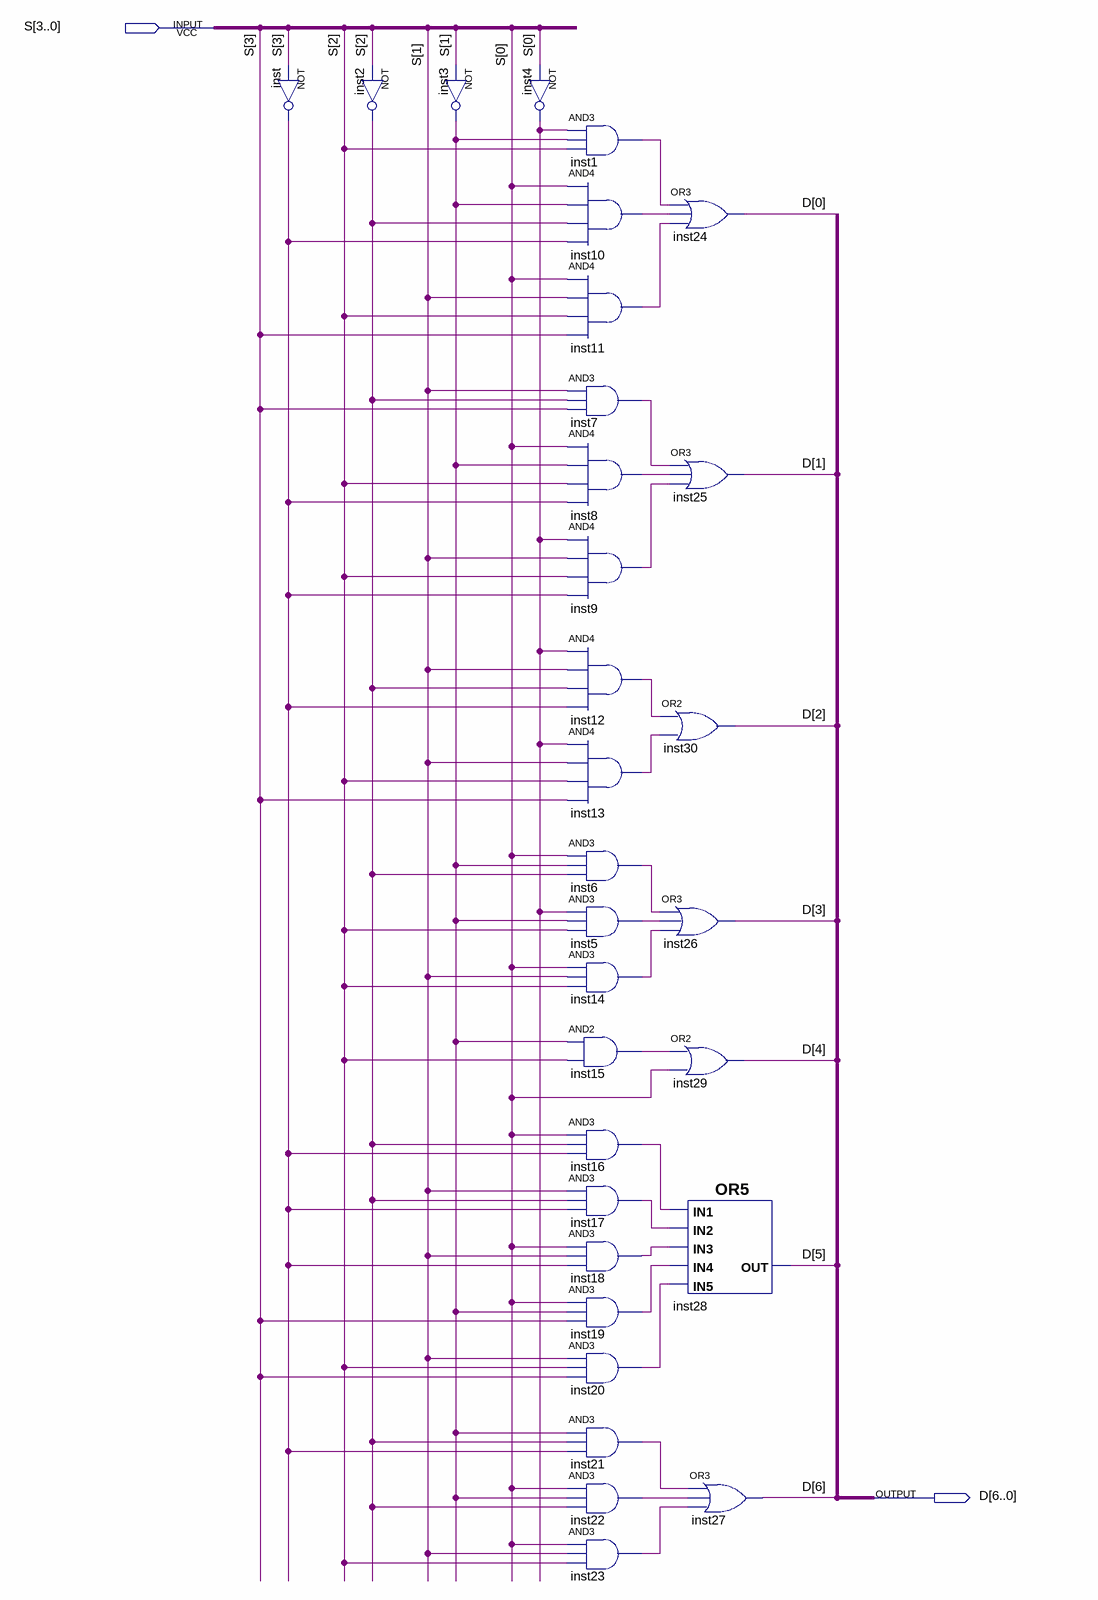
[diagram p0: schematic sheet]
// Quartus schematic DisplayULA.bdf as structural Verilog: 31 symbols, 2 pins
module DisplayULA (
  input  [3:0] S,
  output [6:0] D
);

  wire inst1_out, inst2_out, inst3_out, inst4_out, inst5_out, inst6_out, inst7_out, inst8_out, inst9_out,
       inst10_out, inst11_out, inst12_out, inst13_out, inst14_out, inst15_out, inst16_out, inst17_out,
       inst18_out, inst19_out, inst20_out, inst21_out, inst22_out, inst23_out, inst_out;

  not inst (inst_out, S[3]);
  not inst2 (inst2_out, S[2]);
  not inst3 (inst3_out, S[1]);
  not inst4 (inst4_out, S[0]);
  and inst1 (inst1_out, inst4_out, inst3_out, S[2]);
  and inst10 (inst10_out, S[0], inst3_out, inst2_out, inst_out);
  and inst11 (inst11_out, S[0], S[1], S[2], S[3]);
  and inst7 (inst7_out, S[1], inst2_out, S[3]);
  and inst8 (inst8_out, S[0], inst3_out, S[2], inst_out);
  and inst9 (inst9_out, inst4_out, S[1], S[2], inst_out);
  and inst12 (inst12_out, inst4_out, S[1], inst2_out, inst_out);
  and inst13 (inst13_out, inst4_out, S[1], S[2], S[3]);
  and inst6 (inst6_out, S[0], inst3_out, inst2_out);
  and inst5 (inst5_out, inst4_out, inst3_out, S[2]);
  and inst14 (inst14_out, S[0], S[1], S[2]);
  and inst15 (inst15_out, inst3_out, S[2]);
  and inst16 (inst16_out, S[0], inst2_out, inst_out);
  and inst17 (inst17_out, S[1], inst2_out, inst_out);
  and inst18 (inst18_out, S[0], S[1], inst_out);
  and inst19 (inst19_out, S[0], inst3_out, S[3]);
  and inst20 (inst20_out, S[1], S[2], S[3]);
  and inst21 (inst21_out, inst3_out, inst2_out, inst_out);
  and inst22 (inst22_out, S[0], inst3_out, inst2_out);
  and inst23 (inst23_out, S[0], S[1], S[2]);
  or inst24 (D[0], inst1_out, inst10_out, inst11_out);
  or inst25 (D[1], inst7_out, inst8_out, inst9_out);
  or inst30 (D[2], inst12_out, inst13_out);
  or inst26 (D[3], inst6_out, inst5_out, inst14_out);
  or inst29 (D[4], inst15_out, S[0]);
  or inst28 (D[5], inst16_out, inst17_out, inst18_out, inst19_out, inst20_out);
  or inst27 (D[6], inst21_out, inst22_out, inst23_out);
endmodule
